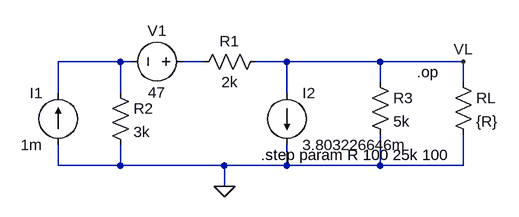
[diagram p0: schematic 21101298_CSE250_2(iv).asc]
21101298_CSE250_2(iv).asc, the LTspice schematic file:
Version 4
SHEET 1 880 680
WIRE 0 80 -96 80
WIRE 16 80 0 80
WIRE 128 80 96 80
WIRE 256 80 208 80
WIRE 400 80 256 80
WIRE 528 80 400 80
WIRE 400 112 400 80
WIRE 528 112 528 80
WIRE -96 128 -96 80
WIRE 0 128 0 80
WIRE 256 128 256 80
WIRE -96 240 -96 208
WIRE 0 240 0 208
WIRE 0 240 -96 240
WIRE 160 240 0 240
WIRE 256 240 256 208
WIRE 256 240 160 240
WIRE 400 240 400 192
WIRE 400 240 256 240
WIRE 528 240 528 192
WIRE 528 240 400 240
WIRE 160 272 160 240
FLAG 160 272 0
FLAG 528 80 VL
SYMBOL voltage 112 80 R90
WINDOW 0 -32 56 VBottom 2
WINDOW 3 32 56 VTop 2
SYMATTR InstName V1
SYMATTR Value 47
SYMBOL current -96 208 R180
WINDOW 0 24 80 Left 2
WINDOW 3 24 0 Left 2
SYMATTR InstName I1
SYMATTR Value 1m
SYMBOL current 256 128 R0
SYMATTR InstName I2
SYMATTR Value 3.803226646m
SYMBOL res 112 96 R270
WINDOW 0 32 56 VTop 2
WINDOW 3 0 56 VBottom 2
SYMATTR InstName R1
SYMATTR Value 2k
SYMBOL res 384 96 R0
SYMATTR InstName R3
SYMATTR Value 5k
SYMBOL res 512 96 R0
SYMATTR InstName RL
SYMATTR Value {R}
SYMBOL res -16 112 R0
SYMATTR InstName R2
SYMATTR Value 3k
TEXT 216 224 Left 2 !.step param R 100 25k 100
TEXT 456 96 Left 2 !.op

The netlist it stands for:
* 21101298_CSE250_2(iv).asc
V1 N002 N001 47
I1 0 N001 1m
I2 VL 0 3.803226646m
R1 N002 VL 2k
R3 VL 0 5k
RL VL 0 {R}
R2 N001 0 3k
.step param R 100 25k 100
.op
.backanno
.end